# EAGLE design 0763-graviton (EAGLE 9.6.1)
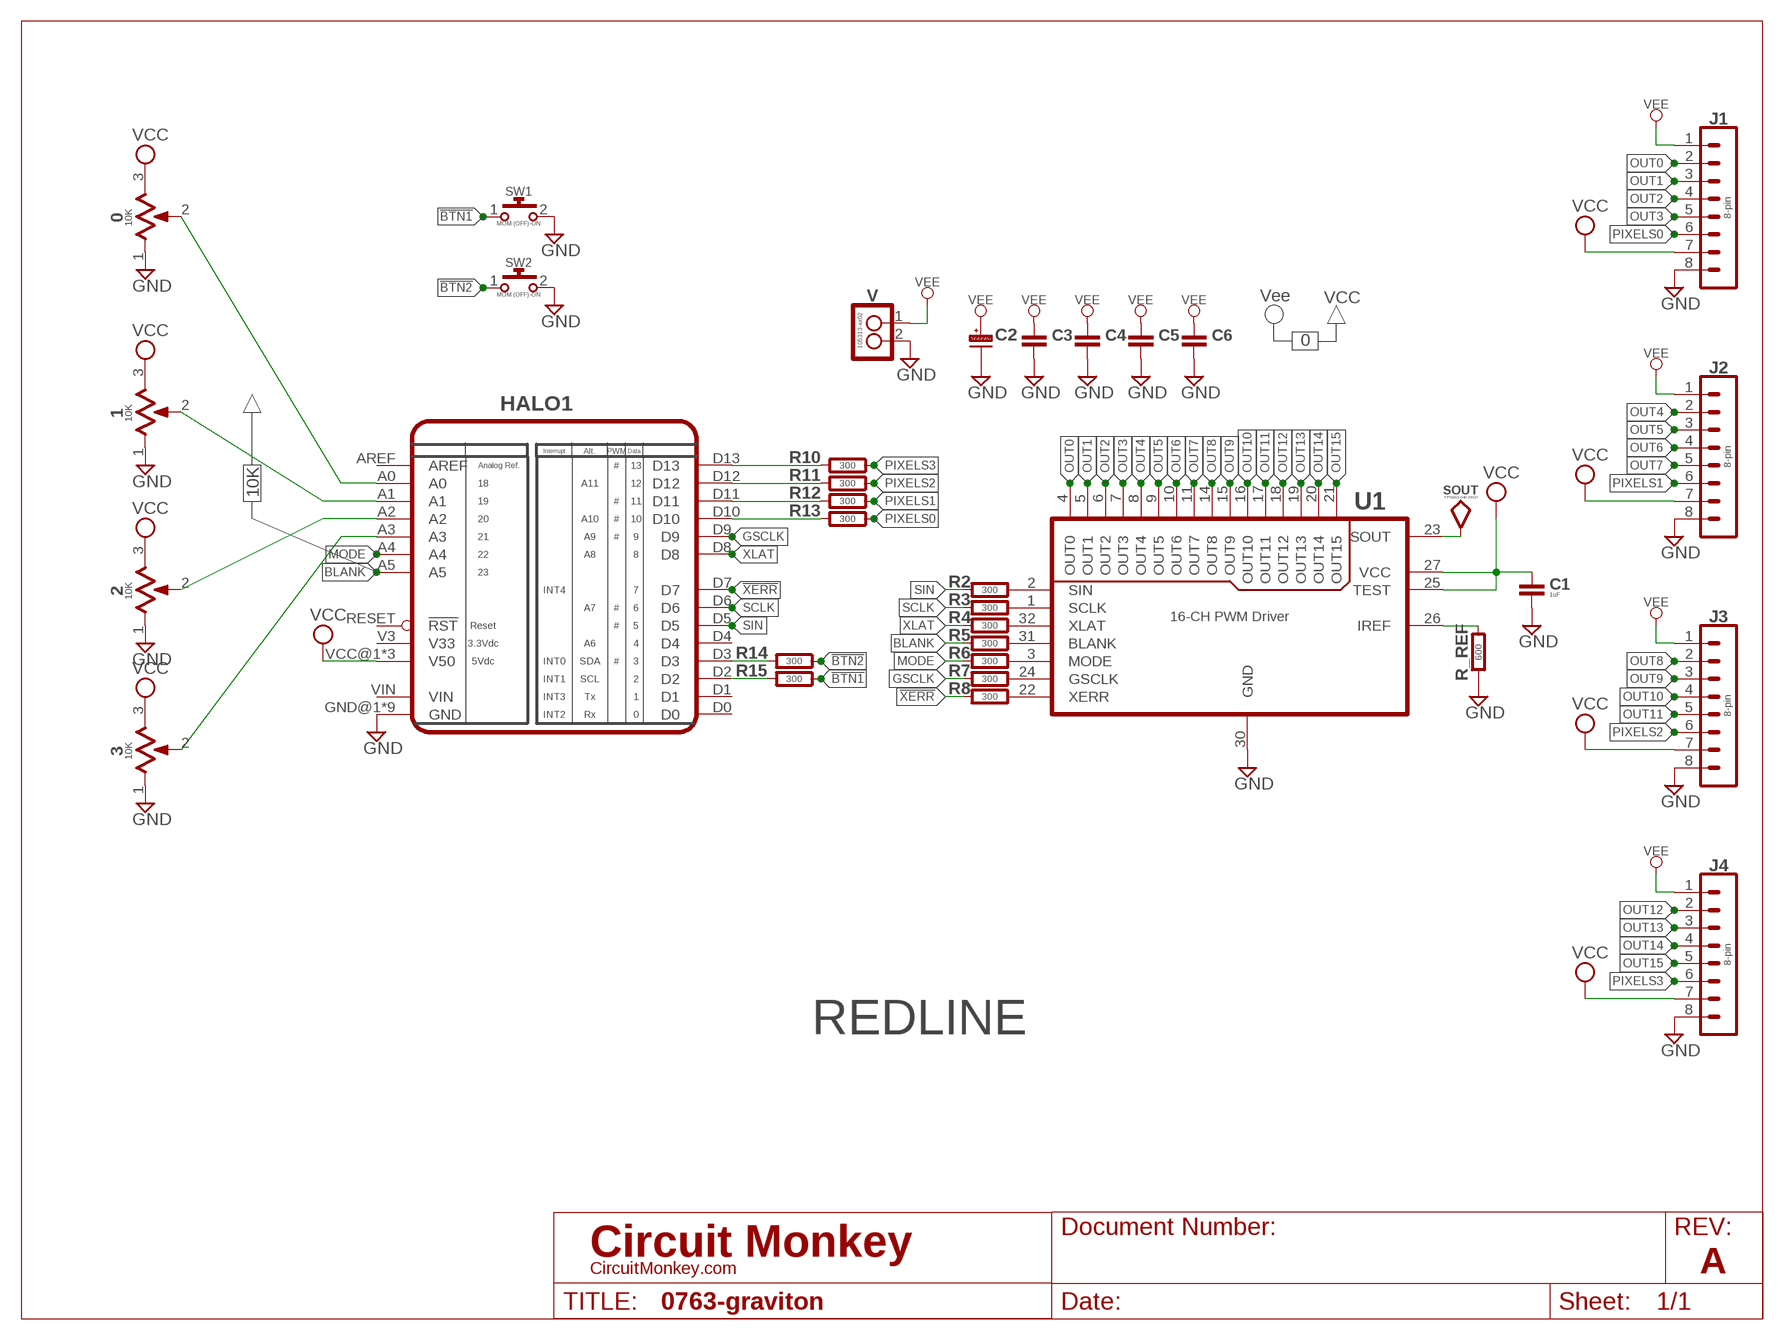
[diagram p0: schematic, sheet 1]
U$1 (LETTER_L-CIRCUITMONKEY): REV: A

## Parts
0  10K  POTRK09?113  [ALPS_RK09D113]
1  10K  POTRK09?113  [ALPS_RK09D113]
2  10K  POTRK09?113  [ALPS_RK09D113]
3  10K  POTRK09?113  [ALPS_RK09D113]
C1  1uF  CAPACITOR0603  [0603-CAP]
C2  CAPACITOR_POL-ALUM-SMT-10  [CAP_ALUM_SMT_10]
C3  CAPACITOR1210  [1210-CAP]
C4  CAPACITOR1210  [1210-CAP]
C5  CAPACITOR1210  [1210-CAP]
C6  CAPACITOR1210  [1210-CAP]
HALO1  HALO-A2  [PCB-HALO-A2-PINS]
J1  8-pin  08PPH-VT-SMD  [B8B-PH-SM4]
J2  8-pin  08PPH-VT-SMD  [B8B-PH-SM4]
J3  8-pin  08PPH-VT-SMD  [B8B-PH-SM4]
J4  8-pin  08PPH-VT-SMD  [B8B-PH-SM4]
R2  300  RESISTOR0603  [0603-RES]
R3  300  RESISTOR0603  [0603-RES]
R4  300  RESISTOR0603  [0603-RES]
R5  300  RESISTOR0603  [0603-RES]
R6  300  RESISTOR0603  [0603-RES]
R7  300  RESISTOR0603  [0603-RES]
R8  300  RESISTOR0603  [0603-RES]
R10  300  RESISTOR0603  [0603-RES]
R11  300  RESISTOR0603  [0603-RES]
R12  300  RESISTOR0603  [0603-RES]
R13  300  RESISTOR0603  [0603-RES]
R14  300  RESISTOR0603  [0603-RES]
R15  300  RESISTOR0603  [0603-RES]
R_REF  600  RESISTOR0603  [0603-RES]
SOUT  TPSMD-040-RND  [SMD-040MIL-RND]
SW1  MOM (OFF)-ON  TACTILE-2PSMD  [SWITCH-0635-2P-SMD]
SW2  MOM (OFF)-ON  TACTILE-2PSMD  [SWITCH-0635-2P-SMD]
U1  16-CH PWM Driver  TLC59401-QFN  [QFN-32]
V  105313-xx02  NANOFIT-02P-SR  [MOLEX-105313-XX02]

## Nets
!BTN1: R15.1 SW1.1
!BTN2: R14.1 SW2.1
!XERR: HALO1.D7 R8.2
BLANK: HALO1.A5 R5.2
GND: 0.1 1.1 2.1 3.1 C1.2 C2.-(N) C3.2 C4.2 C5.2 C6.2 HALO1.GND@1(GND) HALO1.GND@1.2(GND) HALO1.GND@2(GND) HALO1.GND@3(GND) HALO1.GND@4(GND) HALO1.MTG1(GND) HALO1.MTG2(GND) HALO1.MTG3(GND) HALO1.MTG4(GND) J1.8 J2.8 J3.8 J4.8 R_REF.1 SW1.2 SW2.2 U1.30(GND) V.2
GSCLK: HALO1.D9 R7.2
MODE: HALO1.A4 R6.2
N$1: HALO1.D13 R10.2
N$2: HALO1.D12 R11.2
N$3: R_REF.2 U1.26(IREF)
N$4: R2.1 U1.2(SIN)
N$5: R3.1 U1.1(SCLK)
N$6: R4.1 U1.32(XLAT)
N$7: R5.1 U1.31(BLANK)
N$8: R6.1 U1.3(MODE)
N$9: R7.1 U1.24(GSCLK)
N$10: R8.1 U1.22(XERR)
N$11: HALO1.D11 R12.2
N$12: HALO1.D10 R13.2
N$13: 0.2 HALO1.A0
N$14: 1.2 HALO1.A1
N$15: 2.2 HALO1.A2
N$16: 3.2 HALO1.A3
N$17: HALO1.D3 R14.2
N$18: HALO1.D2 R15.2
OUT0: J1.2 U1.4(OUT0)
OUT1: J1.3 U1.5(OUT1)
OUT2: J1.4 U1.6(OUT2)
OUT3: J1.5 U1.7(OUT3)
OUT4: J2.2 U1.8(OUT4)
OUT5: J2.3 U1.9(OUT5)
OUT6: J2.4 U1.10(OUT6)
OUT7: J2.5 U1.11(OUT7)
OUT8: J3.2 U1.14(OUT8)
OUT9: J3.3 U1.15(OUT9)
OUT10: J3.4 U1.16(OUT10)
OUT11: J3.5 U1.17(OUT11)
OUT12: J4.2 U1.18(OUT12)
OUT13: J4.3 U1.19(OUT13)
OUT14: J4.4 U1.20(OUT14)
OUT15: J4.5 U1.21(OUT15)
PIXELS0: J1.6 R13.1
PIXELS1: J2.6 R12.1
PIXELS2: J3.6 R11.1
PIXELS3: J4.6 R10.1
SCLK: HALO1.D6 R3.2
SIN: HALO1.D5 R2.2
SOUT: SOUT.TP U1.23(SOUT)
VCC: 0.3 1.3 2.3 3.3 C1.1 HALO1.VCC@1(V50) HALO1.VCC@2(V50) HALO1.VCC@3(V50) J1.7 J2.7 J3.7 J4.7 U1.25(TEST) U1.27(VCC)
VEE: C2.+(P) C3.1 C4.1 C5.1 C6.1 J1.1 J2.1 J3.1 J4.1 V.1
XLAT: HALO1.D8 R4.2
Unconnected: HALO1.AREF HALO1.D0 HALO1.D1 HALO1.D4 HALO1.RESET(!RST) HALO1.V3(V33) HALO1.VIN

## Notes on the sheet
- Vee | VCC
- 0
- 10K
- REDLINE

## Power pins joined to a net without a drawn wire
GND: 0.MT1A(GND) 0.MT1B(GND) 0.MT1C(GND) 0.MT2A(GND) 0.MT2B(GND) 0.MT2C(GND) 1.MT1A(GND) 1.MT1B(GND) 1.MT1C(GND) 1.MT2A(GND) 1.MT2B(GND) 1.MT2C(GND) 2.MT1A(GND) 2.MT1B(GND) 2.MT1C(GND) 2.MT2A(GND) 2.MT2B(GND) 2.MT2C(GND) 3.MT1A(GND) 3.MT1B(GND) 3.MT1C(GND) 3.MT2A(GND) 3.MT2B(GND) 3.MT2C(GND)

## Library data of the parts
0 1-3 = rlc:POT: Potentiometer with solder mounts; MFR: Alps; MOUSER: https://www.mouser.com/ProductDetail/688-RK09D1130C1B; MPN: RK09D1130C1B
C1 C3-C6 = rlc:CAPACITOR: Capacitor CAP
C2 = rlc:CAPACITOR_POL: Polarized Capacitor
HALO1 = solstice-design-system:HALO: Halo PCB and symbol, ready to hook up.
J1-J4 = con-jst:08P; DIGIKEY: https://www.digikey.com/product-detail/en/jst-sales-america-inc/B8B-PH-SM4-TB-LF-SN/455-1740-1-ND/926837; MFR: JST; MPN: B8B-PH-SM4
R2-R8 R10-R15 R_REF = rlc:RESISTOR: Resistor
SOUT = con-testpoints:TP: Test Point -- Testpoint
SW1 SW2 = switch-smd:TACTILE-2P: Pushbutton Switch, 2 pin, SPST, PCB Mount, THD; MFR: CK Switch; MPN: PTS635S*SMTR; MPN2: Pololu #1400
U1 = co-texas-instruments:TLC59401: 16-CHANNEL LED DRIVER WITH DOT CORRECTION AND GRAYSCALE PWM CONTROL; MFR: Texas Instruments; MOUSER: https://www.mouser.com/ProductDetail/Texas-Instruments/TLC59401RHBR?qs=sGAEpiMZZMtnFuLo2AlFPtoSfKJDVuimuLoLYJhTXxU%3D; MPN: TLC59401RHB
V = con-molex:NANOFIT-02P-SR: NanoFit Single Row 02P

## Board
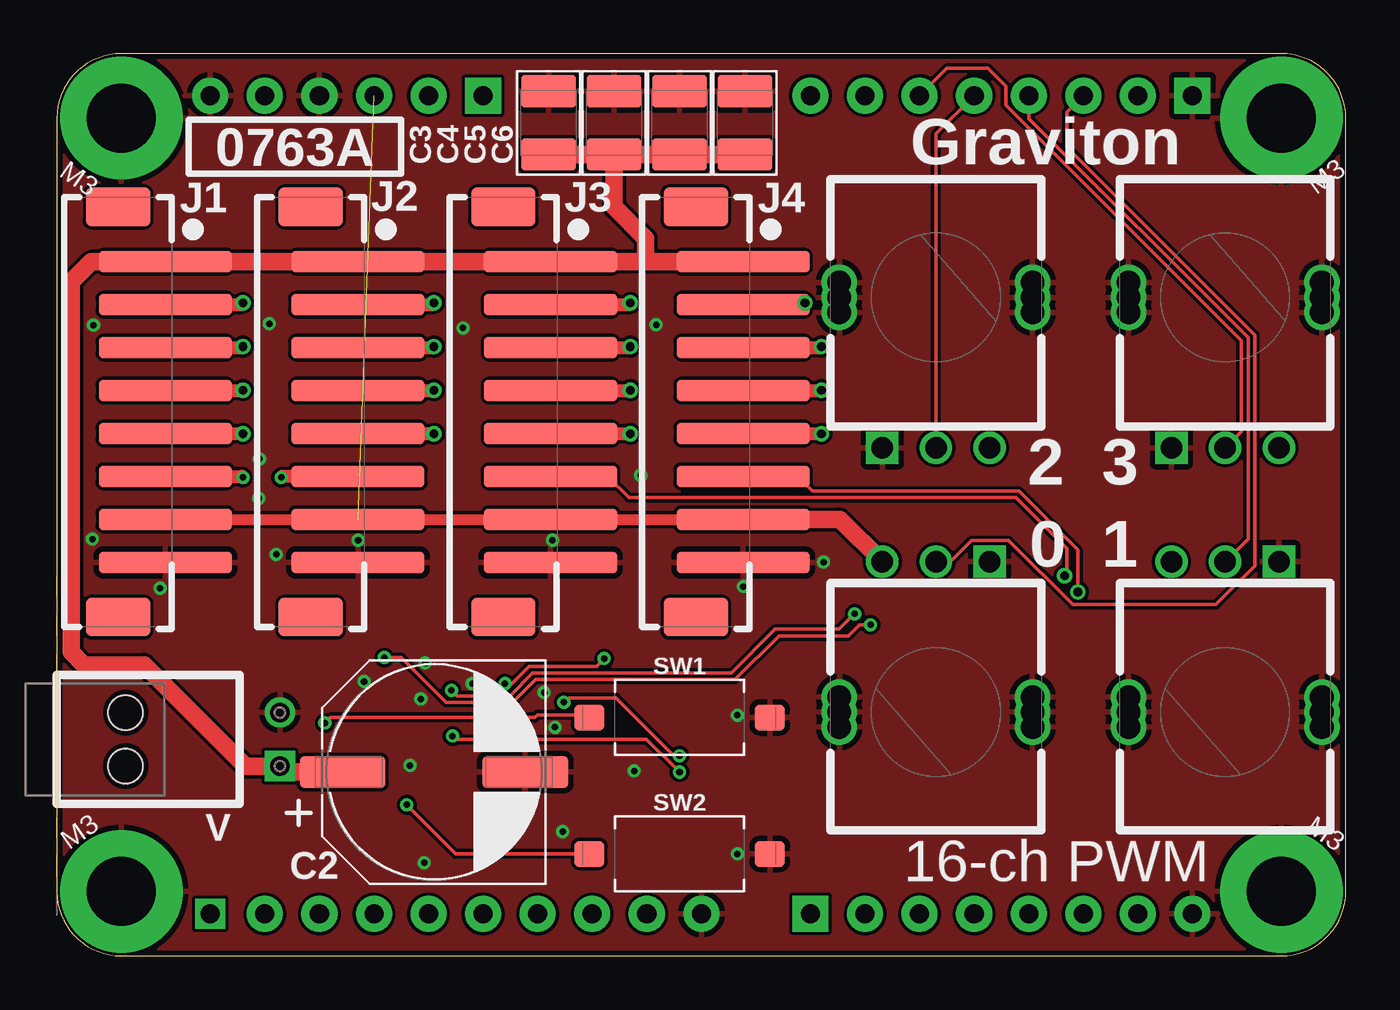
[diagram p1: board, top side]
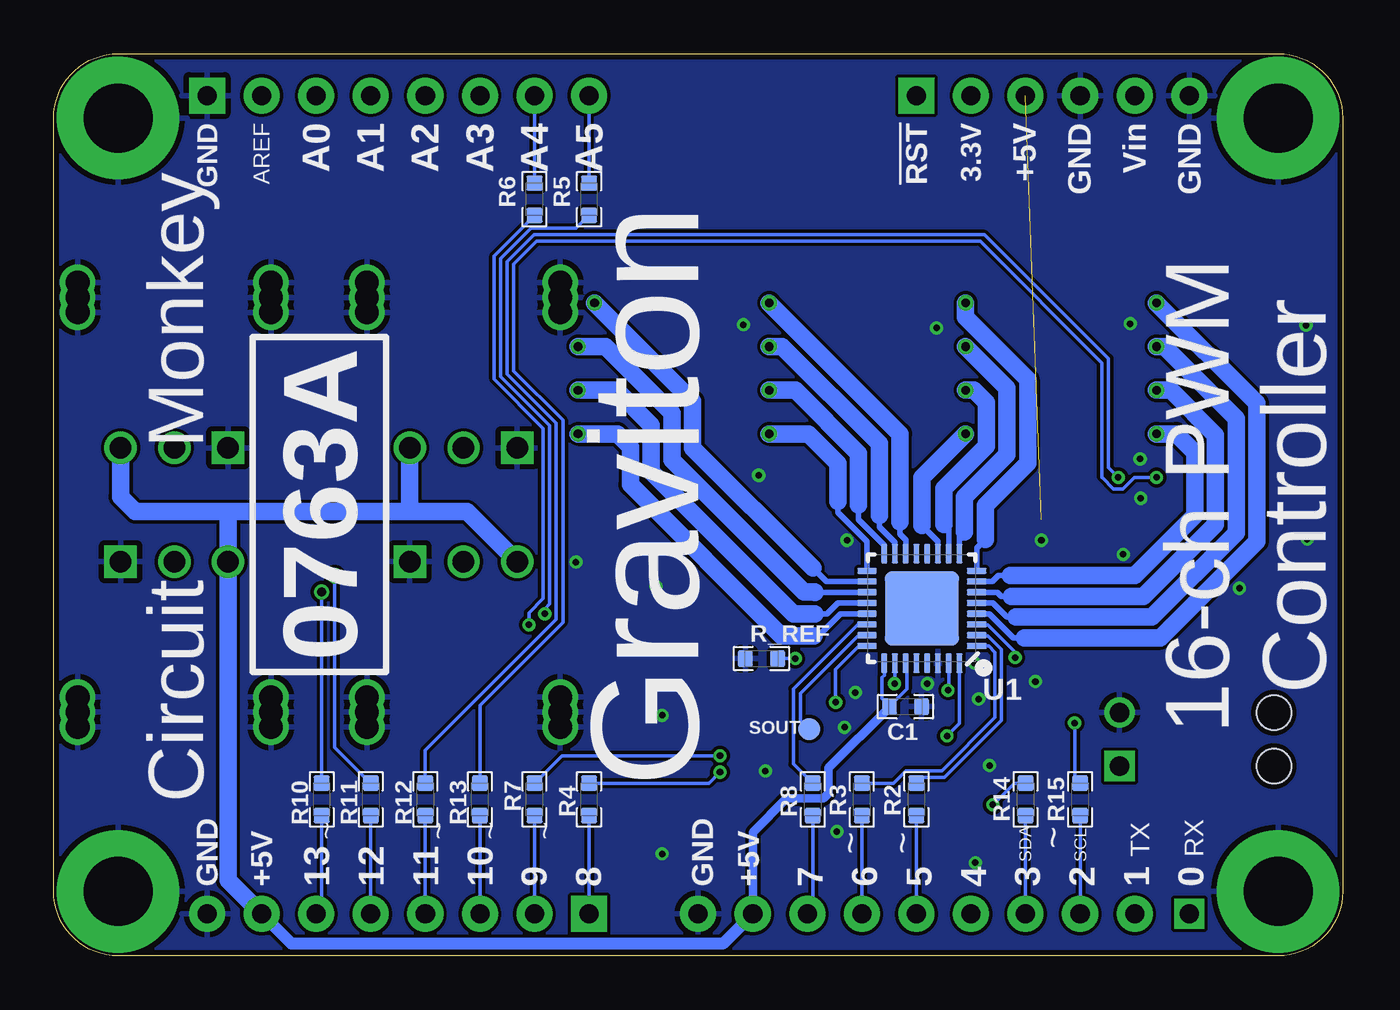
[diagram p2: board, bottom side, seen from below]

Size 60 x 42 mm. Coordinates in mm from the lower left corner, seen from the top.
Copper layers (1*16): Top 0.035mm / dielectric 1.5mm / Bottom 0.035mm
Design rules "SeeedStudio_2layer_2018_marks": minimum track width 6mil, minimum drill 12mil, track to track 6mil, track to pad 6mil, pad to pad 6mil, via to via 6mil, smd to smd 0mil, copper to edge 10mil, drill to drill 10mil, minimum pad ring 10mil, minimum via ring 6mil, stop-mask expansion 2mil, vias tented up to drill 100mil, thermal gap 10mil

### Footprints (pad centres in the part's own frame; a part is rotated, then mirrored left to right if it is on the bottom)
ALPS_RK09D113 = drill 1 square: 1 -2.5,-7 | drill 1: 2 0,-7; 3 2.5,-7 | drill 1.1: MT1A -4.5,-0.7; MT1B -4.5,0; MT1C -4.5,0.7; MT2A 4.5,-0.7; MT2B 4.5,0; MT2C 4.5,0.7
0603-CAP = smd 0.711 x 0.762: 1 -0.752,0; 2 0.752,0
CAP_ALUM_SMT_10 = smd 4 x 1.5: + 4.25,0; - -4.25,0
1210-CAP = smd 1.5 x 2.54: 1 -1.472,0; 2 1.472,0
PCB-HALO-A2-PINS = drill 0.889 pad 1.676: A0 17.78,19.05; A1 15.24,19.05; A2 12.7,19.05; A3 10.16,19.05; A4 7.62,19.05; A5 5.08,19.05; AREF 20.32,19.05; D1 -20.32,-19.05; D2 -17.78,-19.05; D3 -15.24,-19.05; D4 -12.7,-19.05; D5 -10.16,-19.05; D6 -7.62,-19.05; D7 -5.08,-19.05; D9 7.62,-19.05; D10 10.16,-19.05; D11 12.7,-19.05; D12 15.24,-19.05; D13 17.78,-19.05; GND@1 -22.86,19.05; GND@1.2 -17.78,19.05; GND@2 0,-19.05; GND@3 22.86,-19.05; V3 -12.7,19.05; VCC@1 -15.24,19.05; VCC@2 -2.54,-19.05; VCC@3 20.32,-19.05; VIN -20.32,19.05 | drill 0.889 pad 1.397 square: D0 -22.86,-19.05 | drill 0.889 pad 1.676 square: D8 5.08,-19.05; GND@4 22.86,19.05; RESET -10.16,19.05 | drill 3.2 pad 5.7: MTG1 -27,-18; MTG2 -27,18; MTG3 27,18; MTG4 27,-18
B8B-PH-SM4 = smd 1 x 6.2: 1 7,-2.2; 2 5,-2.2; 3 3,-2.2; 4 1,-2.2; 5 -1,-2.2; 6 -3,-2.2; 7 -5,-2.2; 8 -7,-2.2 | smd 1.8 x 3: GND@MT1 9.55,0; GND@MT2 -9.55,0
0603-RES = smd 0.711 x 0.762: 1 -0.752,0; 2 0.752,0
SMD-040MIL-RND = smd 1.016 x 1.016: TP 0,0
SWITCH-0635-2P-SMD = smd 1.4 x 1.2: 1 -4.2,0; 2 4.2,0
QFN-32 = smd 0.9 x 0.28: 1 -2.55,1.75; 2 -2.55,1.25; 3 -2.55,0.75; 4 -2.55,0.25; 5 -2.55,-0.25; 6 -2.55,-0.75; 7 -2.55,-1.25; 8 -2.55,-1.75; 17 2.55,-1.75; 18 2.55,-1.25; 19 2.55,-0.75; 20 2.55,-0.25; 21 2.55,0.25; 22 2.55,0.75; 23 2.55,1.25; 24 2.55,1.75 | smd 0.28 x 0.9: 9 -1.75,-2.55; 10 -1.25,-2.55; 11 -0.75,-2.55; 12 -0.25,-2.55; 13 0.25,-2.55; 14 0.75,-2.55; 15 1.25,-2.55; 16 1.75,-2.55; 25 1.75,2.55; 26 1.25,2.55; 27 0.75,2.55; 28 0.25,2.55; 29 -0.25,2.55; 30 -0.75,2.55; 31 -1.25,2.55; 32 -1.75,2.55 | smd 3.45 x 3.45: PAD 0,0
MOLEX-105313-XX02 = drill 0.9 square: 1 7.18,-1.25 | drill 0.9: 2 7.18,1.25 | hole 1.6: 0,1.25; 0,-1.25

### Placement (x,y rotation side)
0  40.92,11.35 180 top
1  54.38,11.35 180 top
2  40.92,30.65 0 top
3  54.38,30.65 0 top
C1  20.35,11.6 0 bottom
C2  17.55,8.55 180 top
C3  22.89,38.78 90 top
C4  25.94,38.78 90 top
C5  28.98,38.78 90 top
C6  32.03,38.78 90 top
HALO1  30,21 0 top
J1  2.85,25.32 90 top
J2  11.81,25.32 90 top
J3  20.78,25.32 90 top
J4  29.75,25.32 90 top
R2  19.84,7.28 270 bottom
R3  22.38,7.28 270 bottom
R4  35.08,7.28 270 bottom
R5  35.08,35.22 90 bottom
R6  37.62,35.22 90 bottom
R7  37.62,7.28 270 bottom
R8  24.67,7.28 270 bottom
R10  47.53,7.28 270 bottom
R11  45.24,7.28 270 bottom
R12  42.7,7.28 270 bottom
R13  40.16,7.28 270 bottom
R14  14.76,7.28 270 bottom
R15  12.22,7.28 270 bottom
R_REF  27.05,13.84 0 bottom
SOUT  24.83,10.56 0 bottom
SW1  28.98,11.09 0 top
SW2  28.98,4.74 0 top
U1  19.59,16.17 180 bottom
V  3.2,10.08 0 top

### Tracks (layer width: path | path; a pad name or v marks a point on that pad's centre or on a via)
!BTN1  (via drill 0.3)
  Top 0.152: SW1.1 24.66,11.22 22.37,11.22 22.24,11.09 12.73,11.09 v12.47,10.84
  Bottom 0.152: v12.47,10.84 12.47,8.29 R15.1
!BTN2  (via drill 0.3)
  Top 0.152: SW2.1 18.57,4.74 v16.28,7.03
  Bottom 0.152: v16.28,7.03 15.28,8.04 R14.1
!XERR
  Bottom 0.152: R8.2 24.67,2.2 HALO1.D7
BLANK
  Bottom 0.152: R5.2 HALO1.A5
GND  (via drill 0.3)
  other vias: 19.33,12.67 22.68,12.26 17.15,13.63 16.94,11.96 14.3,12.77 16.44,8.86 31.68,11.2 31.68,4.74 23.18,10.64 35.69,18.33 31.96,17.19 23.07,19.35 14.02,19.35 10.21,18.69 1.65,19.4 4.8,17.11 17.1,4.34 23.55,5.79 26.88,8.6 9.88,29.43 18.9,29.23 27.89,29.38 27.18,22.37 9.4,21.3 9.43,23.13 1.7,29.36
  pour Bottom: 0.03,-0.08 59.97,-0.08 59.97,42.08 0.03,42.08
  pour Top: 0.03,-0.08 59.97,-0.08 59.97,42.08 0.03,42.08
GSCLK
  Bottom 0.152: R7.2 HALO1.D9
MODE
  Bottom 0.152: R6.2 HALO1.A4
N$1
  Bottom 0.152: R10.2 47.53,2.2 HALO1.D13
N$2
  Bottom 0.152: R11.2 HALO1.D12
N$3  (via drill 0.3)
  Top 0.152: v25.48,13.84 25.12,13.48 21.97,13.48 21.16,12.67 v20.86,12.67
  Bottom 0.152: U1.26 20.84,12.69 v20.86,12.67 | R_REF.2 v25.48,13.84
N$4
  Bottom 0.152: U1.2 17.01,14.89 16.52,14.89 15.88,14.26 15.88,10.97 18.53,8.31 19.56,8.31 R2.1
N$5
  Bottom 0.152: U1.1 16.48,14.42 16.18,14.13 16.18,11.09 18.66,8.62 20.32,8.62 20.91,8.04 R3.1
N$6  (via drill 0.3)
  Top 0.152: v18.42,10.23 18.57,10.08 27.46,10.08 v28.98,8.55
  Bottom 0.152: v18.42,10.23 17.84,10.81 U1.32 | v28.98,8.55 29.5,8.04 R4.1
N$7  (via drill 0.3)
  Top 0.152: v18.37,12.36 18.62,12.11 21.08,12.11 22.15,13.18 31.4,13.18 33.43,15.21 36.4,15.21 37.11,15.92 v37.14,15.92
  Bottom 0.152: U1.31 18.34,12.38 18.35,12.38 v18.37,12.36 | v37.14,15.92 37.14,16.15 36.91,16.38 36.91,24.68 39.2,26.97 39.2,32.45 37.77,33.88 35.67,33.88 R5.1
N$8  (via drill 0.3)
  Top 0.152: v15.24,13.89 16.03,13.89 18.11,11.8 21.21,11.8 22.28,12.87 31.57,12.87 33.61,14.9 36.86,14.9 37.37,15.41 v37.87,15.41
  Bottom 0.152: U1.3 17.01,15.39 16.52,15.39 15.27,14.15 15.27,13.89 v15.24,13.89 | v37.87,15.41 37.87,15.97 37.21,16.63 37.21,24.56 39.5,26.84 39.5,32.58 R6.1
N$9  (via drill 0.3)
  Top 0.152: v23.6,11.8 23.65,11.8 23.85,12.01 26.04,12.01 28.73,9.32 v28.98,9.32
  Bottom 0.152: U1.24 22.5,14.42 23.6,13.33 v23.6,11.8 | v23.6,11.8 | v28.98,9.32 36.34,9.32 R7.1
N$10
  Bottom 0.152: U1.22 22.57,15.42 25.57,12.43 25.57,8.94 R8.1
N$11
  Bottom 0.152: R12.2 HALO1.D11
N$12
  Bottom 0.152: R13.2 HALO1.D10
N$13
  Top 0.152: 0.2 41.59,18.35 42.57,19.33 44.3,19.33 47.28,16.35 53.95,16.35 55.76,18.15 55.76,28.9 47.02,37.64 47.02,39.29 HALO1.A0
N$14
  Top 0.152: 1.2 55.45,19.41 55.45,28.77 45.24,38.98 HALO1.A1
N$15
  Top 0.152: 2.2 40.92,38.27 HALO1.A2
N$16
  Top 0.152: 3.2 55.15,24.41 55.15,28.63 44.17,39.61 44.17,40.48 43.34,41.32 41.43,41.32 HALO1.A3
N$17
  Bottom 0.152: R14.2 HALO1.D3
N$18
  Bottom 0.152: R15.2 HALO1.D2
OUT0  (via drill 0.41)
  Top 0.61: J1.2 8.58,30.32 v8.66,30.4
  Bottom 0.254: U1.4 16.45,15.92 15.32,14.8 14.81,14.8
  Bottom 0.813: v8.66,30.4 3.99,25.72 3.99,19.29 8.48,14.8 14.81,14.8
OUT1  (via drill 0.41)
  Top 0.61: J1.3 8.62,28.32 v8.66,28.37
  Bottom 0.254: U1.5 16.29,16.42 15.63,15.77 15.22,15.77
  Bottom 0.813: v8.66,28.37 8.31,28.37 4.96,25.01 4.96,19.69 8.88,15.77 15.22,15.77
OUT2  (via drill 0.41)
  Top 0.61: J1.4 8.65,26.32 v8.66,26.33
  Bottom 0.254: 15.42,16.73 15.88,16.73 16.07,16.92 U1.6
  Bottom 0.813: v8.66,26.33 8,26.33 5.92,24.25 5.92,20.09 9.28,16.73 15.42,16.73
OUT3  (via drill 0.41)
  Top 0.61: J1.5 8.65,24.32 v8.66,24.3
  Bottom 0.254: U1.7 16.3,17.42 16.03,17.7 15.47,17.7
  Bottom 0.813: v8.66,24.3 7.75,24.3 6.89,23.44 6.89,20.49 9.68,17.7 15.47,17.7
OUT4  (via drill 0.41)
  Top 0.61: J2.2 17.47,30.32 v17.55,30.4
  Bottom 0.254: U1.8 17.04,18.98 16.64,19.37
  Bottom 0.813: v17.55,30.4 17.55,29.73 14.66,26.84 14.66,22.94 16.64,20.96 16.64,19.37
OUT5  (via drill 0.41)
  Top 0.61: J2.3 17.51,28.32 v17.55,28.37
  Bottom 0.254: U1.9 17.84,19.5 17.61,19.73
  Bottom 0.813: v17.55,28.37 v17.55,28.36 15.62,26.43 15.62,23.34 17.61,21.36 17.61,19.73
OUT6  (via drill 0.41)
  Top 0.61: J2.4 17.54,26.32 v17.55,26.33
  Bottom 0.254: U1.10 18.34,19.85 18.57,20.09
  Bottom 0.813: v17.55,26.33 17.15,26.33 16.59,25.77 16.59,23.74 18.57,21.76 18.57,20.09
OUT7  (via drill 0.41)
  Top 0.61: J2.5 17.54,24.32 v17.55,24.3
  Bottom 0.254: U1.11 18.84,19.29 19.59,20.04
  Bottom 0.813: v17.55,24.3 19.59,22.27 19.59,20.04
OUT8  (via drill 0.41)
  Top 0.61: J3.2 26.62,30.32 v26.7,30.4
  Bottom 0.254: U1.14 20.34,19.36 20.6,19.63 20.6,20.19
  Bottom 0.813: v26.7,30.4 20.6,24.3 20.6,20.19
OUT9  (via drill 0.41)
  Top 0.61: J3.3 26.65,28.32 v26.7,28.37
  Bottom 0.254: U1.15 20.84,19.24 21.57,19.97 21.57,20.49
  Bottom 0.813: v26.7,28.37 26.09,28.37 21.57,23.84 21.57,20.49
OUT10  (via drill 0.41)
  Top 0.61: J3.4 26.68,26.32 v26.7,26.33
  Bottom 0.254: U1.16 21.34,19.11 22.53,20.31 22.53,21
  Bottom 0.813: v26.7,26.33 25.48,26.33 22.53,23.39 22.53,21
OUT11  (via drill 0.41)
  Top 0.61: J3.5 26.68,24.32 v26.7,24.3
  Bottom 0.254: U1.17 22.14,19.28 23.5,20.64 23.5,21.15
  Bottom 0.813: v26.7,24.3 24.87,24.3 23.5,22.93 23.5,21.15
OUT12  (via drill 0.41)
  Top 0.61: J4.2 34.75,30.32 v34.83,30.4
  Bottom 0.254: U1.18 24.04,17.42 24.67,18.05
  Bottom 0.813: v34.83,30.4 30.25,25.83 30.25,23.64 24.67,18.05
OUT13  (via drill 0.41)
  Top 0.61: J4.3 35.54,28.32 v35.59,28.37
  Bottom 0.254: 24.55,16.92 U1.19
  Bottom 0.813: v35.59,28.37 34.32,28.37 31.22,25.27 31.22,23.09 25.07,16.94 24.56,16.94 24.55,16.92
OUT14  (via drill 0.41)
  Top 0.61: J4.4 35.57,26.32 v35.59,26.33
  Bottom 0.254: U1.20 23.5,16.42 24.01,15.92 24.56,15.92
  Bottom 0.813: v35.59,26.33 33.81,26.33 32.18,24.71 32.18,22.54 25.57,15.92 24.56,15.92
OUT15  (via drill 0.41)
  Top 0.61: J4.5 35.57,24.32 v35.59,24.3
  Bottom 0.254: U1.21 23.39,15.92 24.41,14.9 24.61,14.9
  Bottom 0.813: v35.59,24.3 33.76,24.3 33.15,23.69 33.15,21.93 26.12,14.9 24.61,14.9
PIXELS0  (via drill 0.3)
  Top 0.61: J1.6 8.62,22.32 v8.66,22.27
  Bottom 0.152: v8.66,22.27 9.69,22.27 10.22,21.74 10.66,21.74 11.2,22.27 11.2,27.6 16.87,33.27 37.52,33.27 38.59,32.2 38.59,27.22 36.3,24.94 36.3,15.51 40.16,11.65 R13.1
PIXELS1  (via drill 0.3)
  Top 0.61: J2.6 10.49,22.32 v10.44,22.27
  Bottom 0.152: v10.44,22.27 10.9,22.73 10.9,27.81 16.67,33.57 37.64,33.57 38.89,32.33 38.89,27.1 36.6,24.81 36.6,15.67 42.7,9.57 R12.1
PIXELS2  (via drill 0.41)
  Top 0.152: J3.6 25.64,22.32 26.62,21.34 44.65,21.34 47.02,18.97 47.02,17.7 v46.92,17.7
  Bottom 0.152: v46.92,17.7 46.92,9.71 R11.1
PIXELS3  (via drill 0.41)
  Top 0.152: J4.6 34.49,22.32 35.16,21.64 44.78,21.64 47.53,18.89 v47.53,16.94
  Bottom 0.152: v47.53,16.94 R10.1
SCLK
  Bottom 0.152: R3.2 HALO1.D6
SIN
  Bottom 0.152: R2.2 HALO1.D5
SOUT
  Bottom 0.152: U1.23 22.17,14.89 22.56,14.89 25.23,12.22 25.23,10.96 SOUT.TP
VCC  (1 unrouted)
  Top 0.508: J1.7 J2.7 J3.7 J4.7
  Top 0.813: J4.7 36.45,20.32 0.3
  Bottom 0.152: U1.25 21.34,13.06 21.44,12.96 21.44,11.99 21.1,11.65 C1.1 20.29,12.42 20.29,13.57 U1.27
  Bottom 0.406: HALO1.VCC@2 27.46,5.75 25.88,7.32 24.18,7.32 23.93,7.57 23.93,8.74 21.1,11.57 C1.1
  Bottom 0.559: HALO1.VCC@2 28.85,0.56 48.93,0.56 HALO1.VCC@3
  Bottom 0.813: HALO1.VCC@3 51.88,3.51 1.3 | 3.3 56.88,21.37 56.2,20.68 51.88,20.68 | 51.88,18.65 1.3 | 51.88,20.68 1.3 | 0.3 40.76,20.68 43.46,20.68 | 51.88,20.68 43.46,20.68 | 2.3 43.42,20.72 43.46,20.68
VEE
  Top 0.813: J4.1 27.41,32.32 | 27.41,32.32 J3.1 J2.1 J1.1 1.61,32.32 0.66,31.38 0.66,14.14 1.26,13.55 4.06,13.55 8.78,8.83 V.1 10.66,8.55 C2.+ | C3.1 C4.1 | C6.1 C5.1 C4.1 | C4.1 25.94,34.87 27.41,33.39 27.41,32.32
XLAT
  Bottom 0.152: R4.2 HALO1.D8

### Text on the board
tPlace: Graviton | 0763A | 16-ch PWM
bPlace: 16-ch PWM / Controller | Graviton | Circuit Monkey | 0763A